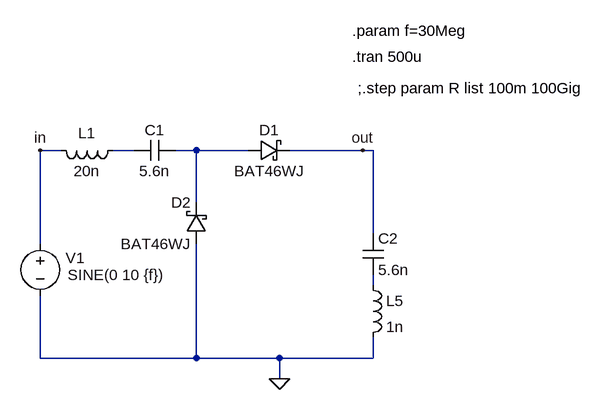
[diagram p0: schematic peak_detector_double_diode.asc]
peak_detector_double_diode.asc, the LTspice schematic file:
Version 4
SHEET 1 1120 680
WIRE -80 48 -112 48
WIRE 32 48 0 48
WIRE 128 48 96 48
WIRE 208 48 128 48
WIRE 384 48 272 48
WIRE 400 48 384 48
WIRE 128 128 128 48
WIRE 400 176 400 48
WIRE -112 192 -112 48
WIRE 400 256 400 240
WIRE -112 368 -112 272
WIRE 128 368 128 192
WIRE 128 368 -112 368
WIRE 256 368 128 368
WIRE 400 368 400 336
WIRE 400 368 256 368
WIRE 256 400 256 368
FLAG 384 48 out
FLAG -112 48 in
FLAG 256 400 0
SYMBOL schottky 208 64 R270
WINDOW 0 32 32 VTop 2
WINDOW 3 0 32 VBottom 2
SYMATTR InstName D1
SYMATTR Value BAT46WJ
SYMATTR Description Diode
SYMATTR Type diode
SYMBOL voltage -112 176 R0
WINDOW 3 42 64 Left 2
WINDOW 123 24 124 Left 2
WINDOW 39 0 0 Left 0
WINDOW 0 39 38 Left 2
SYMATTR Value SINE(0 10 {f})
SYMATTR InstName V1
SYMBOL ind 16 32 R90
WINDOW 0 5 56 VBottom 2
WINDOW 3 32 56 VTop 2
SYMATTR InstName L1
SYMATTR Value 20n
SYMBOL cap 384 176 R0
SYMATTR InstName C2
SYMATTR Value 5.6n
SYMBOL ind 384 240 R0
SYMATTR InstName L5
SYMATTR Value 1n
SYMBOL schottky 144 192 R180
WINDOW 0 24 64 Left 2
WINDOW 3 24 0 Left 2
SYMATTR InstName D2
SYMATTR Value BAT46WJ
SYMATTR Description Diode
SYMATTR Type diode
SYMBOL cap 96 32 R90
WINDOW 0 0 32 VBottom 2
WINDOW 3 32 32 VTop 2
SYMATTR InstName C1
SYMATTR Value 5.6n
TEXT 368 -136 Left 2 !.param f=30Meg
TEXT 368 -96 Left 2 !.tran 500u
TEXT 376 -48 Left 2 !;.step param R list 100m 100Gig

The netlist it stands for:
* peak_detector_double_diode.asc
D1 N002 out BAT46WJ
V1 in 0 SINE(0 10 {f})
L1 N001 in 20n
C2 out N003 5.6n
L5 N003 0 1n
D2 0 N002 BAT46WJ
C1 N002 N001 5.6n
.model D D
.lib standard.dio
.param f=30Meg
.tran 500u
;.step param R list 100m 100Gig
.backanno
.end